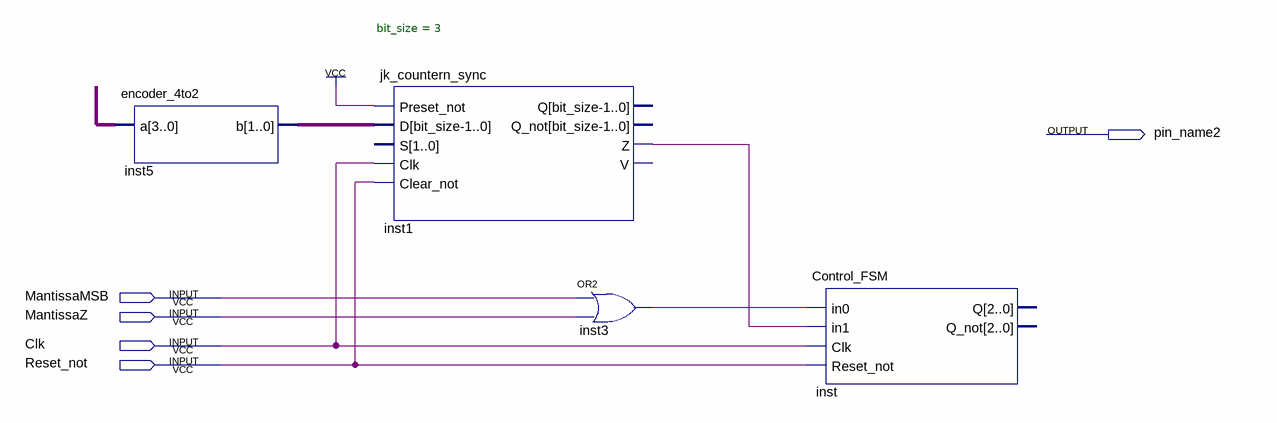
[diagram p0: schematic sheet]
// Quartus schematic Controller.bdf as structural Verilog: 4 symbols, 5 pins
module Controller (
  input  MantissaMSB,
  input  MantissaZ,
  input  Clk,
  input  Reset_not,
  output pin_name2
);

  wire inst1_z, inst3_out;
  wire [2:0] inst5_b;
  wire [3:0] undriven;

  encoder_4to2 inst5 (.a(undriven), .b(inst5_b));
  jk_countern_sync #(.bit_size(3)) inst1 (
    .Preset_not(1'b1), .D(inst5_b), .Clk(Clk), .Clear_not(Reset_not), .Z(inst1_z));  // open: S, Q, Q_not, V
  or inst3 (inst3_out, MantissaMSB, MantissaZ);
  Control_FSM inst (.in0(inst3_out), .in1(inst1_z), .Clk(Clk), .Reset_not(Reset_not));  // open: Q, Q_not
endmodule
